# EasyEDA schematic EasyEDA_SCH_Display_2023-01-10.json
TITLE: Sheet_1; REV: 1.0; Date: 2022-11-19; Sheet: 1/1; Drawn By: cwbruner; Company: My Hobby
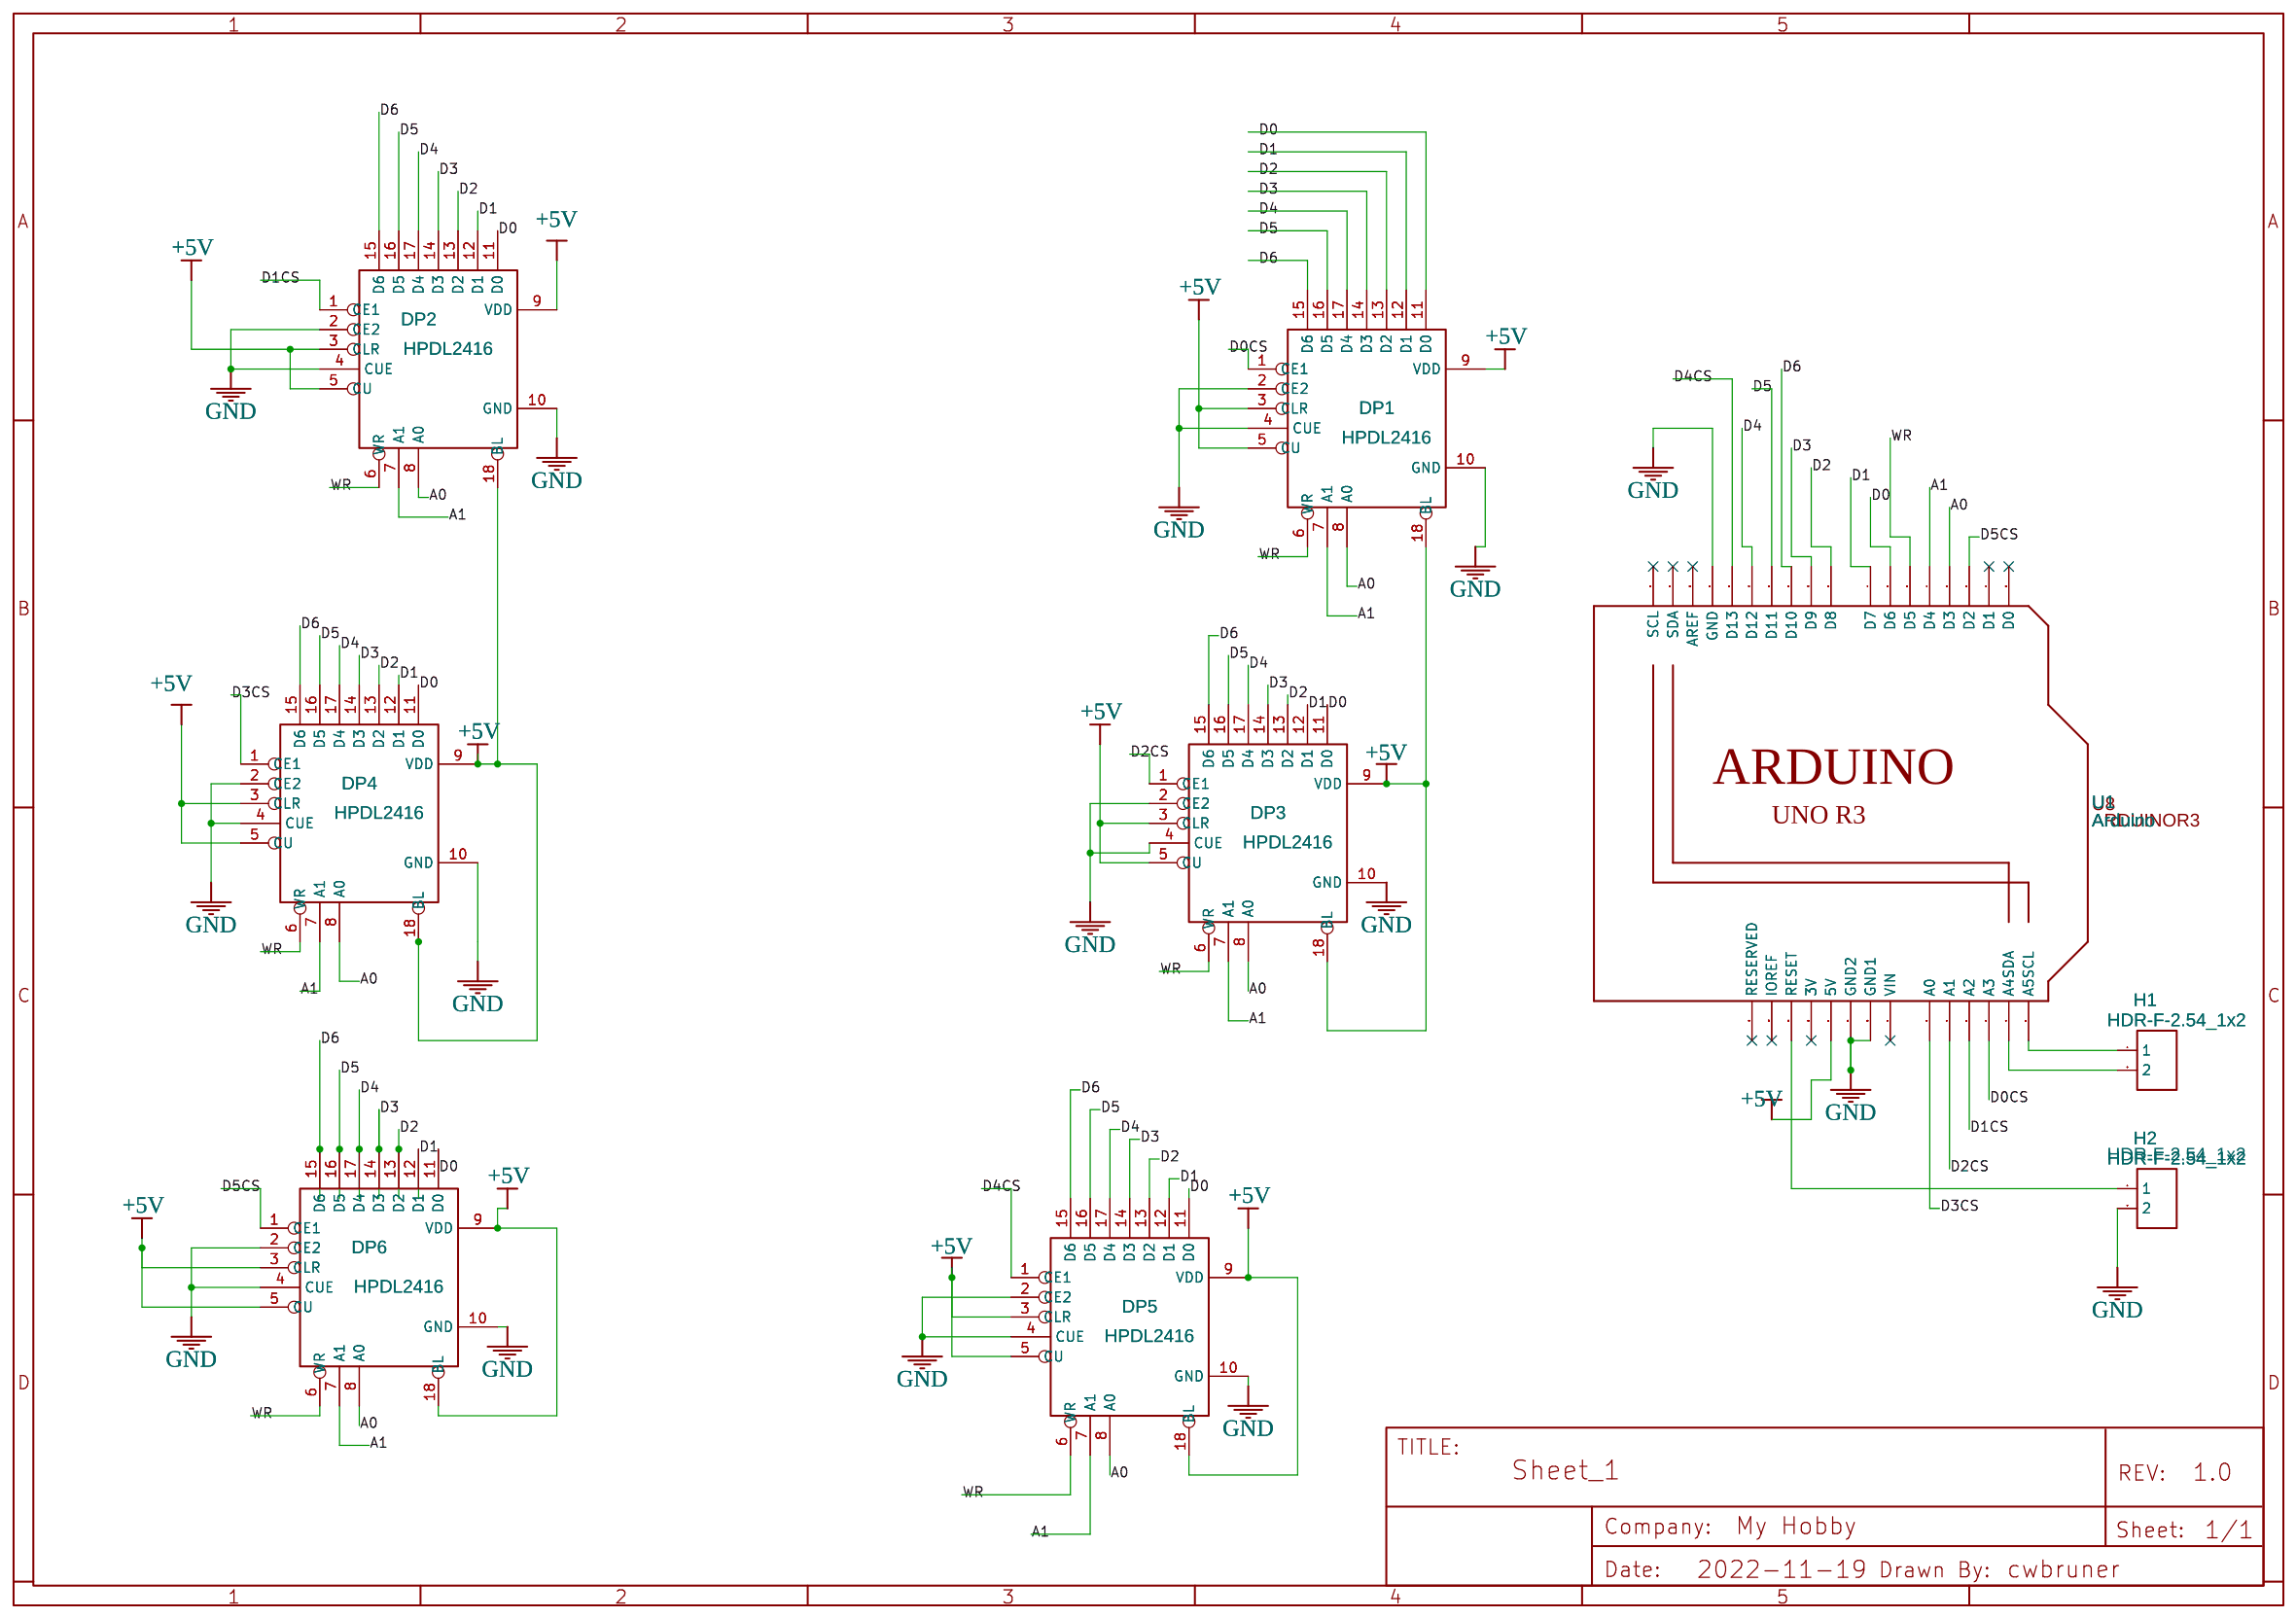
[diagram p0: schematic sheet]

## Parts
DP1  HPDL2416  [HPDL2416]
DP2  HPDL2416  [HPDL2416]
DP3  HPDL2416  [HPDL2416]
DP4  HPDL2416  [HPDL2416]
DP5  HPDL2416  [HPDL2416]
DP6  HPDL2416  [HPDL2416]
H1  HDR-F-2.54_1x2  [HDR-F-2.54_1X2]
H2  HDR-F-2.54_1x2  [HDR-F-2.54_1X2]
U1  Arduino  [E14_ARDUINO_PUBLISHED_ARDUINO_UNO]

## Library data of the parts
DP1-DP6 = HPDL2416: catid: 20; Contributor: jwatson; Supplier Part: HPDL-2416; sim: true
H1 H2 = HDR-F-2.54_1x2: Supplier Part: C49661; Supplier: LCSC; Contributor: LCEDA_Lib
U1 = Arduino: catid: 20; Contributor: junaid97; sim: true

## Nets
+5V: DP1.3(CLR) DP1.5(CU) DP1.9(VDD) DP1.18(BL) DP2.3(CLR) DP2.5(CU) DP2.9(VDD) DP2.18(BL) DP3.3(CLR) DP3.5(CU) DP3.9(VDD) DP3.18(BL) DP4.3(CLR) DP4.5(CU) DP4.9(VDD) DP4.18(BL) DP5.3(CLR) DP5.5(CU) DP5.9(VDD) DP5.18(BL) DP6.3(CLR) DP6.5(CU) DP6.9(VDD) DP6.18(BL) U1.5V
GND: DP1.2(CE2) DP1.4(CUE) DP1.10(GND) DP2.2(CE2) DP2.4(CUE) DP2.10(GND) DP3.2(CE2) DP3.4(CUE) DP3.10(GND) DP4.2(CE2) DP4.4(CUE) DP4.10(GND) DP5.2(CE2) DP5.4(CUE) DP5.10(GND) DP6.2(CE2) DP6.4(CUE) DP6.10(GND) H2.2 U1.GND(GND2)
A0: DP1.8(A0) DP2.8(A0) DP3.8(A0) DP4.8(A0) DP5.8(A0) DP6.8(A0) U1.3(D3)
A1: DP1.7(A1) DP2.7(A1) DP3.7(A1) DP4.7(A1) DP5.7(A1) DP6.7(A1) U1.4(D4)
D0: DP1.11(D0) DP2.11(D0) DP3.11(D0) DP4.11(D0) DP5.11(D0) DP6.11(D0) U1.6(D6)
D0CS: DP1.1(CE1) U1.A3
D1: DP1.12(D1) DP2.12(D1) DP3.12(D1) DP4.12(D1) DP5.12(D1) DP6.12(D1) U1.7(D7)
D1CS: DP2.1(CE1) U1.A2
D2: DP1.13(D2) DP2.13(D2) DP3.13(D2) DP4.13(D2) DP5.13(D2) DP6.13(D2) U1.8(D8)
D2CS: DP3.1(CE1) U1.A1
D3: DP1.14(D3) DP2.14(D3) DP3.14(D3) DP4.14(D3) DP5.14(D3) DP6.14(D3) U1.9(D9)
D3CS: DP4.1(CE1) U1.A0
D4: DP1.17(D4) DP2.17(D4) DP3.17(D4) DP4.17(D4) DP5.17(D4) DP6.17(D4) U1.12(D12)
D4CS: DP5.1(CE1) U1.13(D13)
D5: DP1.16(D5) DP2.16(D5) DP3.16(D5) DP4.16(D5) DP5.16(D5) DP6.16(D5) U1.11(D11)
D5CS: DP6.1(CE1) U1.2(D2)
D6: DP1.15(D6) DP2.15(D6) DP3.15(D6) DP4.15(D6) DP5.15(D6) DP6.15(D6) U1.10(D10)
WR: DP1.6(WR) DP2.6(WR) DP3.6(WR) DP4.6(WR) DP5.6(WR) DP6.6(WR) U1.5(D5)
Net-(H1-1): H1.1 U1.A5(A5SCL)
Net-(H1-2): H1.2 U1.A4(A4SDA)
Net-(H2-1): H2.1 U1.RESET

Not connected (* = marked no-connect by the designer): U1 0(D0)* 1(D1)* 3.3V(3V)* AREF* I/OREF(IOREF)* N/C(RESERVED)* SCL* SDA* VIN*

## Notes on the sheet
- HDR-F-2.54_1x2
